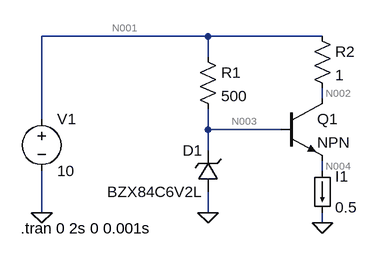
[diagram p0: schematic schemat3.asc]
schemat3.asc, the LTspice schematic file:
Version 4
SHEET 1 880 680
WIRE -80 192 -336 192
WIRE 96 192 -80 192
WIRE -80 224 -80 192
WIRE 96 288 96 272
WIRE -336 320 -336 192
WIRE -80 336 -80 304
WIRE 32 336 -80 336
WIRE -80 368 -80 336
WIRE 96 400 96 384
WIRE -336 464 -336 400
WIRE -80 464 -80 432
WIRE 96 480 96 464
FLAG -336 464 0
FLAG -80 464 0
FLAG 96 480 0
SYMBOL voltage -336 304 R0
WINDOW 123 0 0 Left 0
WINDOW 39 0 0 Left 0
SYMATTR InstName V1
SYMATTR Value 10
SYMBOL zener -64 432 R180
WINDOW 0 24 64 Left 2
WINDOW 3 24 0 Left 2
SYMATTR InstName D1
SYMATTR Value BZX84C6V2L
SYMATTR Description Diode
SYMATTR Type diode
SYMBOL res -96 208 R0
SYMATTR InstName R1
SYMATTR Value 500
SYMBOL npn 32 288 R0
SYMATTR InstName Q1
SYMBOL load 80 400 R0
WINDOW 123 0 0 Left 0
WINDOW 39 0 0 Left 0
SYMATTR InstName I1
SYMATTR Value 0.5
SYMBOL res 80 176 R0
SYMATTR InstName R2
SYMATTR Value 1
TEXT -368 488 Left 2 !.tran 0 2s 0 0.001s

The netlist it stands for:
* schemat3.asc
V1 N001 0 10
D1 0 N003 BZX84C6V2L
R1 N001 N003 500
Q1 N002 N003 N004 0 NPN
I1 N004 0 0.5
R2 N001 N002 1
.model D D
.lib standard.dio
.model NPN NPN
.model PNP PNP
.lib standard.bjt
.tran 0 2s 0 0.001s
.backanno
.end

* Results of the author's LTspice run, read from the files saved beside the schematic
* Operating Point, zero values left out:
*   V(n001) = 10 V
*   V(n003) = 6.272 V
*   V(n002) = 9.505 V
*   V(n004) = 5.338 V
*   Ic(Q1) = 495 mA
*   Ib(Q1) = 4.95 mA
*   Ie(Q1) = -500 mA
*   I(D1) = -2.505 mA
*   I(I1) = 500 mA
*   I(R1) = 7.455 mA
*   I(R2) = 495 mA
*   I(V1) = -502.5 mA